# Altium schematic sheet EspIC.SchDoc
size A4; CheckedBy: Everyone how cares; DocumentNumber: 4; SheetNumber: 4; SheetTotal: 4
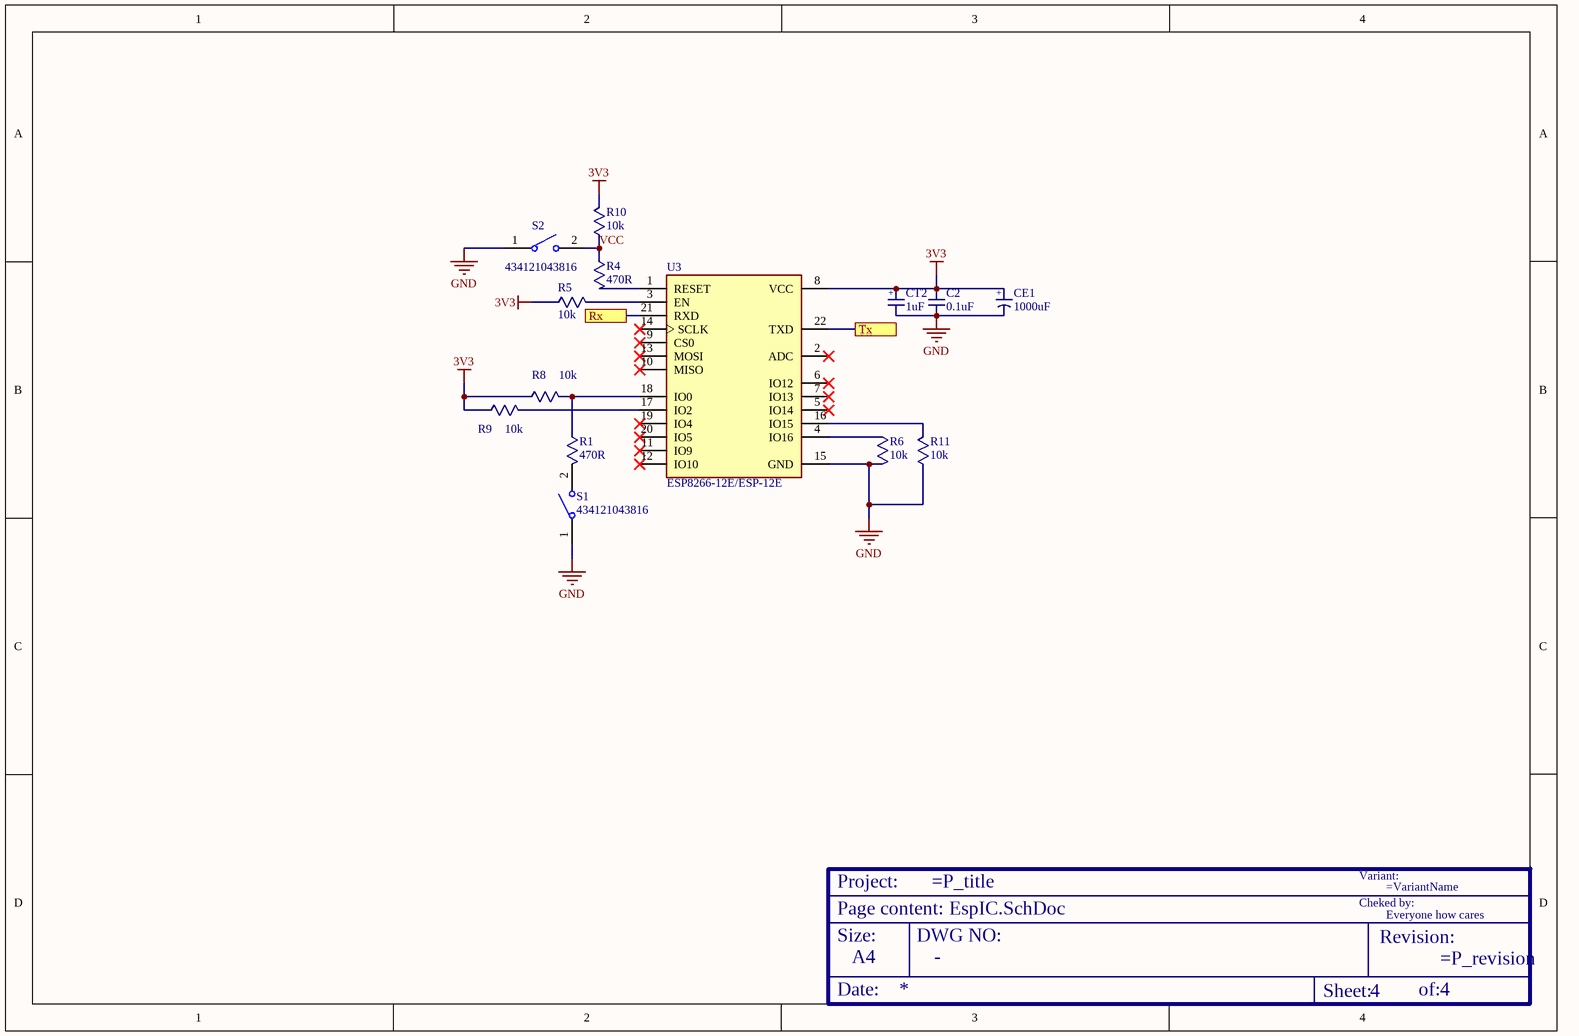
[diagram p0: EspIC.SchDoc]

## Parts
?  Size: A4  (hidden comment: TitleBox)  (graphical)
C2  value 0.1uF  [0603C]  (hidden comment: Ceramic Capacitor)
CE1  value 1000uF  [WCAP-AS5H_8x10.5]  (hidden comment: Eletrolitic Capacitor)
CT2  value 1uF  [0603T]  (hidden comment: Tantalum capacitor)
R1  value 470R  [0603]  (hidden comment: Res)
R4  value 470R  [0603]  (hidden comment: Res)
R5  value 10k  [0603]  (hidden comment: Res)
R6  value 10k  [0603]  (hidden comment: Res)
R8  value 10k  [0603]  (hidden comment: Res)
R9  value 10k  [0603]  (hidden comment: Res)
R10  value 10k  [0603]  (hidden comment: Res)
R11  value 10k  [0603]  (hidden comment: Res)
S1  value 434121043816  [434121043816]  (hidden comment: Swich)
S2  value 434121043816  [434121043816]  (hidden comment: Swich)
U3  ESP8266-12E/ESP-12E  [XCVR_ESP8266-12E/ESP-12E]

## Ports
Rx, Tx

## Nets
3V3: C2.1 CE1.1 CT2.1 R5.1 R8.1 R9.1 R10.2 U3.8(VCC)
GND: C2.2 CE1.2 CT2.2 R6.2 R11.1 S1.1 S2.1 U3.15(GND)
Rx: U3.21(RXD) ; port Rx
Tx: U3.22(TXD) ; port Tx
VCC: R4.1 R10.1 S2.2
NetR1_1: R1.1 R8.2 U3.18(IO0)
NetR1_2: R1.2 S1.2
NetR4_2: R4.2 U3.1(RESET)
NetR5_2: R5.2 U3.3(EN)
NetR6_1: R6.1 U3.4(IO16)
NetR9_2: R9.2 U3.17(IO2)
NetR11_2: R11.2 U3.16(IO15)

Not connected (* = marked no-connect by the designer): U3 2(ADC)* 5(IO14)* 6(IO12)* 7(IO13)* 9(CS0)* 10(MISO)* 11(IO9)* 12(IO10)* 13(MOSI)* 14(SCLK)* 19(IO4)* 20(IO5)*

## Notes on the sheet
- (in symbol CE) +
- (in symbol CT) +
- (in symbol TitleBox_1) Variant:; Project:; Cheked by:; Page content:; Size:; DWG NO:; Revision:; Date:; Sheet:; of:

## Library data of the parts
? = TitleBox_1: coordenadas: (610;20) Size A4; DWG No: -
C2 = CC: notas: *
CE1 = CE: notas: MCVVT6R3M102FB3L
CT2 = CT: Condensador Tantalum; notas: TMCJ1C105MTRF
S1 S2 = switch 2 patas smd: 6x3.5mm SMD WS-TASV, height 4.3 mm, 160 gf; notas: *
U3 = ESP8266-12E/ESP-12E: This WiFi module has a 32-bit MCU micro and clock speeds supporting 80 MHz or 160 MHz. Supports the RTOS and integrated Wi-Fi MAC/BB/RF/PA/LNA, and has an on-board antenna.; MF: AI-Thinker; Price: None; Package: None; Value: *; MP: ESP8266-12E/ESP-12E; Availability: Unavailable; SnapEDA_Link: https://www.snapeda.com/parts/ESP8266-12E/ESP-12E/AI-Thinker/view-part/106414/?ref=snap
R1 R4-R6 R8-R11 = Res: notas: *